# EAGLE schematic solderstation_v1_6 (EAGLE 7.4.0)
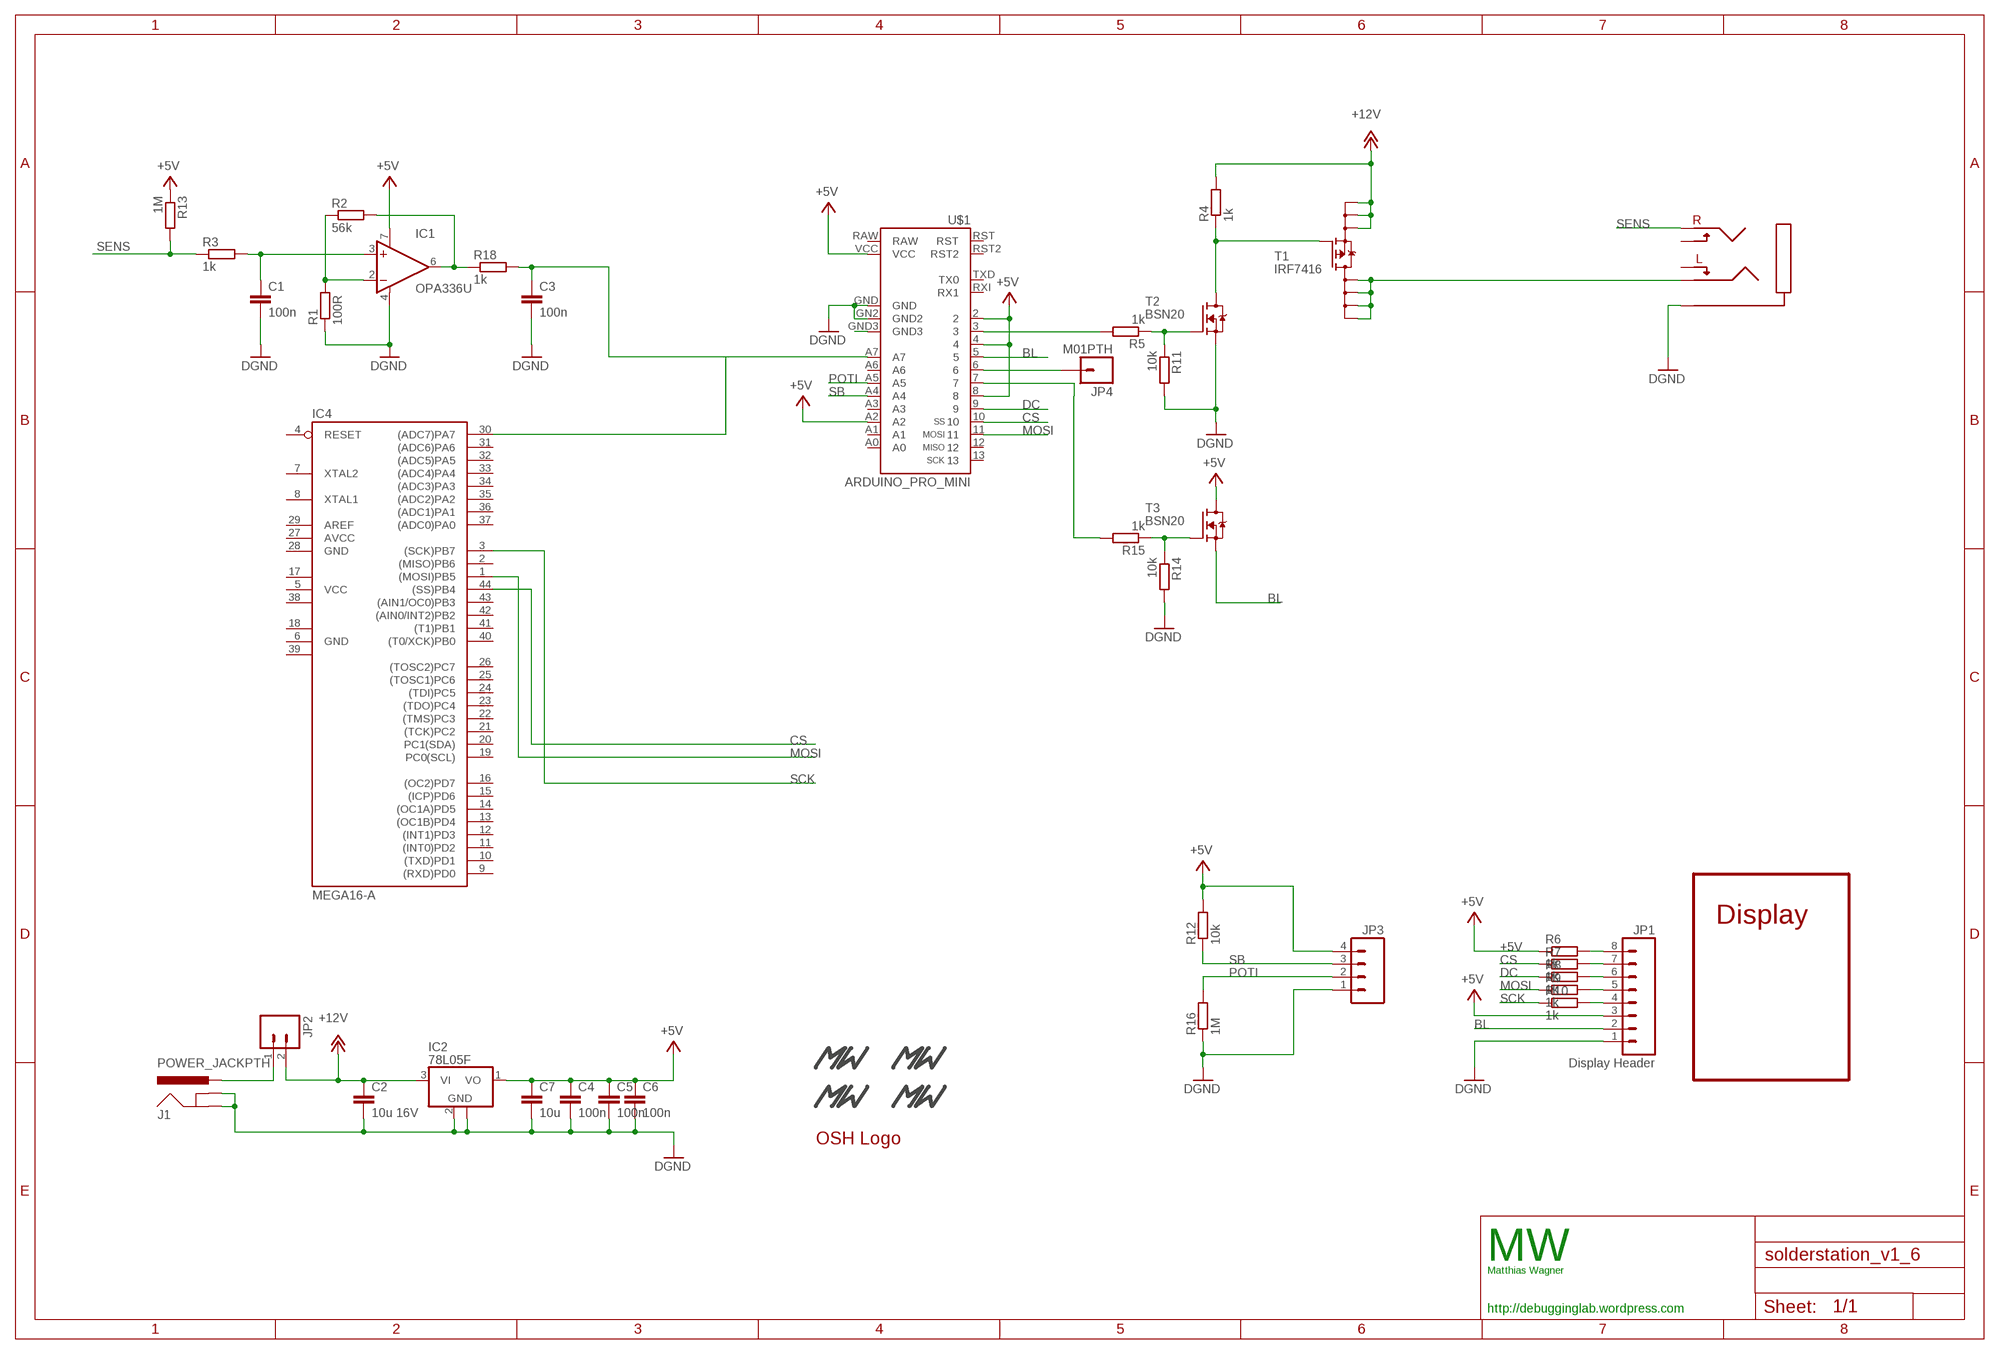
[diagram p0: schematic, sheet 1]

## Parts
C1  100n  C-EUC0603  [C0603]
C2  10u 16V  C-EUC1206  [C1206]
C3  100n  C-EUC0603  [C0603]
C4  100n  C-EUC0603  [C0603]
C5  100n  C-EUC0603  [C0603]
C6  100n  C-EUC0603  [C0603]
C7  10u  C-EUC1206  [C1206]
IC1  OPA336U  [SO08]
IC2  78L05F  [SOT89]
IC4  MEGA16-A  [TQFP44]
J1  POWER_JACKPTH  [POWER_JACK_PTH]
JP1  Display Header  M08LOCK  [1X08_LOCK]
JP2  M02LOCK_LONGPADS  [1X02_LOCK_LONGPADS]
JP3  M04LOCK  [1X04_LOCK]
JP4  M01PTH  [1X01]
R1  100R  R-EU_R0603  [R0603]
R2  56k  R-EU_R0603  [R0603]
R3  1k  R-EU_R0603  [R0603]
R4  1k  R-EU_R0603  [R0603]
R5  1k  R-EU_R0603  [R0603]
R6  1k  R-EU_R0603  [R0603]
R7  1k  R-EU_R0603  [R0603]
R8  1k  R-EU_R0603  [R0603]
R9  1k  R-EU_R0603  [R0603]
R10  1k  R-EU_R0603  [R0603]
R11  10k  R-EU_R0603  [R0603]
R12  10k  R-EU_R0603  [R0603]
R13  1M  R-EU_R0603  [R0603]
R14  10k  R-EU_R0603  [R0603]
R15  1k  R-EU_R0603  [R0603]
R16  1M  R-EU_R0603  [R0603]
R18  1k  R-EU_R0603  [R0603]
T1  IRF7416  [SO8]
T2  BSN20  [SOT23]
T3  BSN20  [SOT23]
U$1  ARDUINO_PRO_MINI  [ARDUINO_PRO_MINI]
U$2  AUDIO_JACK_3,5MMCONRAD  [AUDIO_JACK_3,5MM_CONRAD]
U$3  MW_LOGO  [MW_11X5MM]
U$4  MW_LOGO_SOLDER  [MW_11X5MM_SOLDER]
U$5  MW_LOGO  [MW_11X5MM]
U$8  OSH_LOGOS  [OSH_LOGO_S]
U$9  MW_LOGO_SOLDER  [MW_11X5MM_SOLDER]

## Nets
+5V: C4.1 C5.1 C6.1 C7.1 IC1.7(V+) IC2.1(VO) JP1.3 JP3.4 R6.1 R12.2 R13.1 T3.3(D) U$1.2 U$1.4 U$1.8 U$1.A2 U$1.VCC
+12V: C2.1 IC2.3(VI) JP2.2 R4.2 T1.1(S0) T1.2(S1) T1.3(S2)
BL: JP1.2 T3.2(S) U$1.5
CS: IC4.44((SS)PB4) R7.1 U$1.10
DC: R8.1 U$1.9
DGND: C1.2 C2.2 C3.2 C4.2 C5.2 C6.2 C7.2 IC1.4(V-) IC2.2(GND) IC2.2@1(GND) J1.GND J1.GNDBREAK JP1.1 JP3.1 R1.1 R11.2 R14.2 R16.1 T2.2(S) U$1.GN2(GND2) U$1.GND U$2.P_GND
HEATER: T1.5(D0) T1.6(D1) T1.7(D2) T1.8(D3) U$2.P_LEFT
MOSI: IC4.1((MOSI)PB5) R9.1 U$1.11
N$1: IC1.2(-IN) R1.2 R2.1
N$2: IC1.6(OUT) R2.2 R18.1
N$3: R5.1 R11.1 T2.1(G)
N$4: C1.1 IC1.3(+IN) R3.2
N$5: R4.1 T1.4(G) T2.3(D)
N$6: JP1.4 R10.2
N$7: R5.2 U$1.3
N$8: JP1.5 R9.2
N$9: JP1.6 R8.2
N$10: JP1.7 R7.2
N$11: JP1.8 R6.2
N$12: U$1.GND3
N$13: J1.PWR JP2.1
N$14: R14.1 R15.1 T3.1(G)
N$15: R15.2 U$1.7
N$16: JP4.1 U$1.6
N$31: C3.1 IC4.30((ADC7)PA7) R18.2 U$1.A7
POTI: JP3.2 R16.2 U$1.A5
SB: JP3.3 R12.1 U$1.A4
SCK: IC4.3((SCK)PB7) R10.1
SENS: R3.1 R13.2 U$2.P_RIGHT
Unconnected: IC4.2((MISO)PB6) IC4.4(RESET) IC4.7(XTAL2) IC4.8(XTAL1) IC4.9((RXD)PD0) IC4.10((TXD)PD1) IC4.11((INT0)PD2) IC4.12((INT1)PD3) IC4.13((OC1B)PD4) IC4.14((OC1A)PD5) IC4.15((ICP)PD6) IC4.16((OC2)PD7) IC4.19(PC0(SCL)) IC4.20(PC1(SDA)) IC4.21((TCK)PC2) IC4.22((TMS)PC3) IC4.23((TDO)PC4) IC4.24((TDI)PC5) IC4.25((TOSC1)PC6) IC4.26((TOSC2)PC7) IC4.29(AREF) IC4.31((ADC6)PA6) IC4.32((ADC5)PA5) IC4.33((ADC4)PA4) IC4.34((ADC3)PA3) IC4.35((ADC2)PA2) IC4.36((ADC1)PA1) IC4.37((ADC0)PA0) IC4.40((T0/XCK)PB0) IC4.41((T1)PB1) IC4.42((AIN0/INT2)PB2) IC4.43((AIN1/OC0)PB3) U$1.12 U$1.13 U$1.A0 U$1.A1 U$1.A3 U$1.A6 U$1.RAW U$1.RST U$1.RST2 U$1.RXI(RX1) U$1.TXD(TX0) U$2.P_G_L U$2.P_G_R

## Notes on the sheet
- Display
- MW
- Matthias Wagner
- http://debugginglab.wordpress.com

## Power pins joined to a net without a drawn wire
AVCC: IC4.27(AVCC)
GND: IC4.6(GND) IC4.28(GND)
GND1: IC4.18(GND1)
GND2: IC4.39(GND2)
VCC: IC4.5(VCC)
VCC1: IC4.17(VCC1)
VCC2: IC4.38(VCC2)

## Library data of the parts
C1-C7 = rcl:C-EU: CAPACITOR, European symbol
IC1 = burr-brown:OPA336: CMOS Operational Amplifiers Single-Supply, MicroPower, MicroAmplifier(TM) Series; MF: TEXAS INSTRUMENT CONNECTORS; MPN: OPA336UA; OC_FARNELL: 1459587; OC_NEWARK: 35C1888
IC2 = linear:78L*: POSITOIV-VOLTAGE REGULATORS Output up to 100 mA Source: http://focus.ti.com/lit/ds/symlink/ua78l05.pdf
IC4 = atmel:MEGA16: MICROCONTROLLER 16 Kbytes FLASH 1 kbytes SRAM 512 bytes EEPROM USART 8-channel 10 bit ADC Source: avr.lbr; MPN: ATMEGA16-16AU; OC_FARNELL: 9171134; OC_NEWARK: 96K6515
J1 = SparkFun:POWER_JACK: Power Jack This is the standard 5.5mm barrel jack for power. The PTH is the most common, proven, reliable, footprint. All others are experimental. The Slot footprint only works if the mill layer is transmitted to the PCB fab house so be warned. Spark Fun Electronics SKU : PRT-00119. Mating wall wart : TOL-00298 (and others)
JP1 = SparkFun:M08: Header 8 Standard 8-pin 0.1" header. Use with straight break away headers (SKU : PRT-00116), right angle break away headers (PRT-00553), swiss pins (PRT-00743), machine pins (PRT-00117), and female headers (PRT-00115).
JP2 = SparkFun:M02: Header 2 Standard 2-pin 0.1" header. Use with straight break away headers (SKU : PRT-00116), right angle break away headers (PRT-00553), swiss pins (PRT-00743), machine pins (PRT-00117), and female headers (PRT-00115). Molex polarized connector foot print use with SKU : PRT-08233 with associated crimp pins and housings.
JP3 = SparkFun:M04: Header 4 Standard 4-pin 0.1" header. Use with straight break away headers (SKU : PRT-00116), right angle break away headers (PRT-00553), swiss pins (PRT-00743), machine pins (PRT-00117), and female headers (PRT-00115). Molex polarized connector foot print use with SKU : PRT-08231 with associated crimp pins and housings. 1MM SMD Version SKU: PRT-10208
JP4 = SparkFun:M01: Header 1 Standard 1-pin 0.1" header. Use with straight break away headers (SKU : PRT-00116), right angle break away headers (PRT-00553), swiss pins (PRT-00743), machine pins (PRT-00117), and female headers (PRT-00115).
R1-R16 R18 = rcl:R-EU_: RESISTOR, European symbol
T1 = IRF74xx:IRF7416
T2 T3 = bsn20:BSN20
U$1 = SparkFun:ARDUINO_PRO_MINI
U$2 = Matthias:AUDIO_JACK_3,5MM
U$3 U$5 = MWlogo:MW_LOGO
U$4 U$9 = MWlogo:MW_LOGO_SOLDER
U$8 = Logos:OSH_LOGO